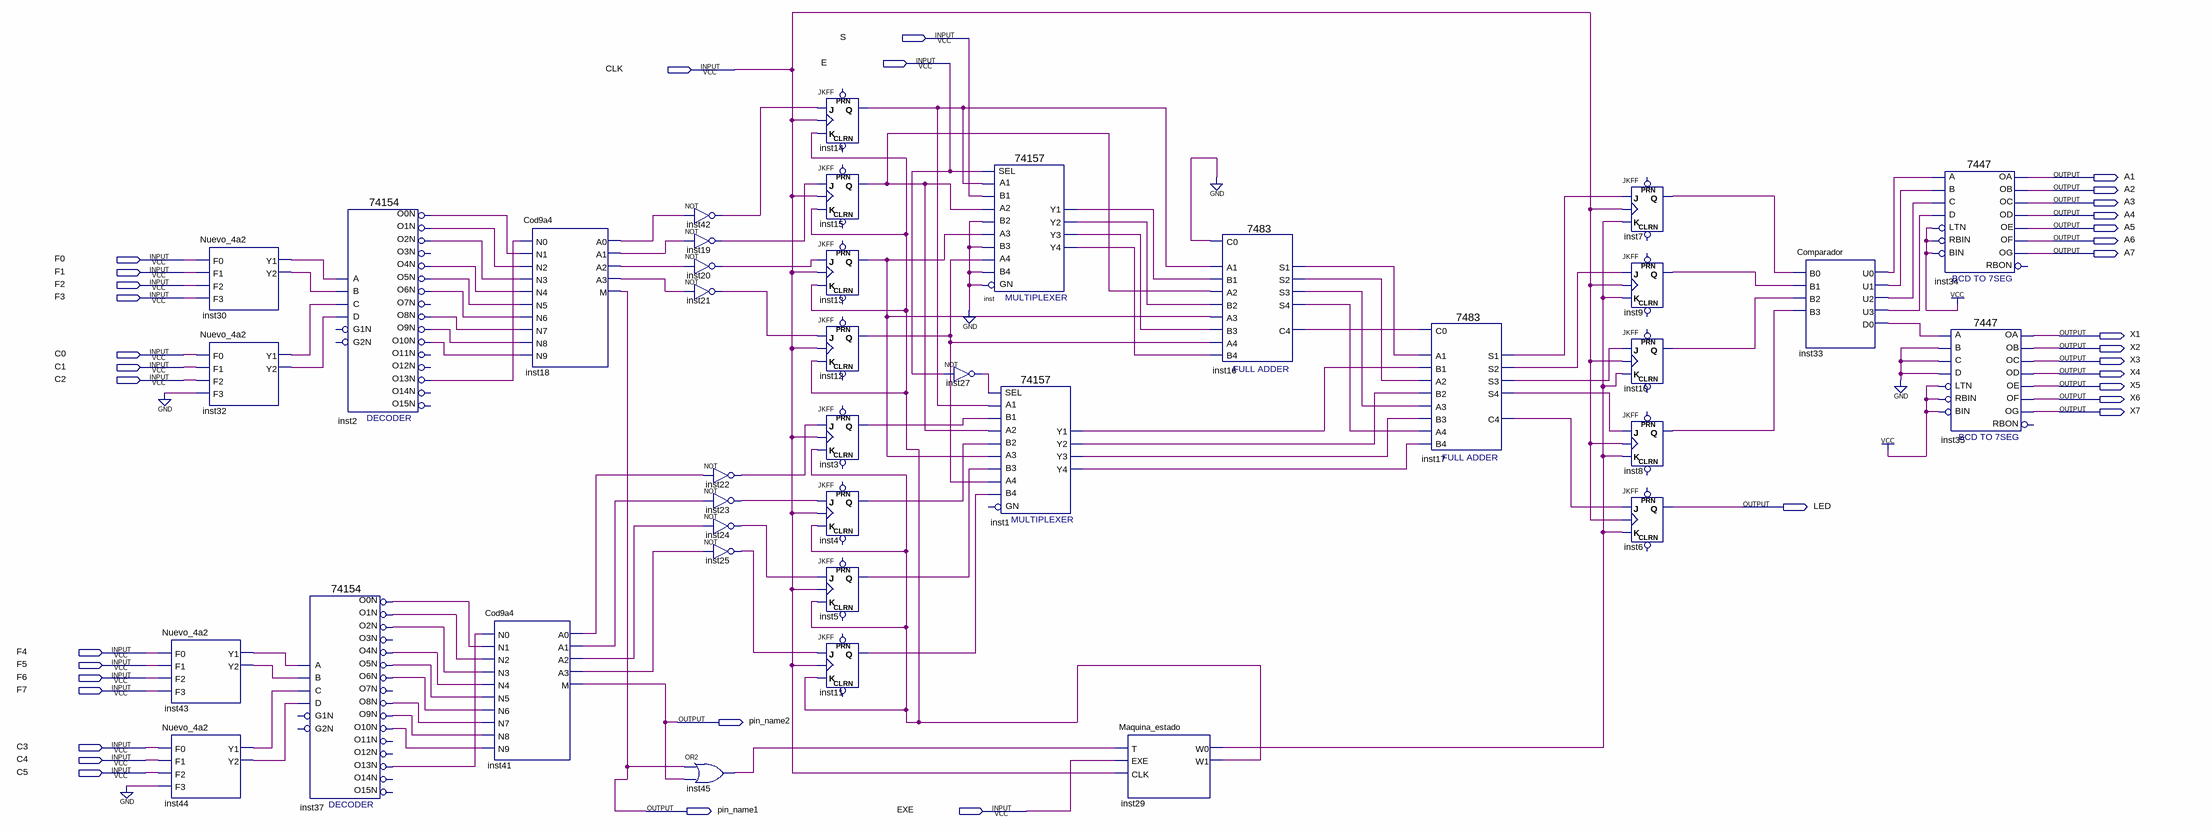
[diagram p0: schematic sheet]
// Quartus schematic Final_Digitales.bdf as structural Verilog: 39 symbols, 35 pins
module Final_Digitales (
  input  S,
  input  E,
  input  CLK,
  input  F0,
  input  F1,
  input  F2,
  input  F3,
  input  C0,
  input  C1,
  input  C2,
  input  F4,
  input  F5,
  input  F6,
  input  F7,
  input  C3,
  input  C4,
  input  C5,
  input  EXE,
  output A1,
  output A2,
  output A3,
  output A4,
  output A5,
  output A6,
  output A7,
  output X1,
  output X2,
  output X3,
  output X4,
  output X5,
  output X6,
  output X7,
  output LED,
  output pin_name2,
  output pin_name1
);

  wire inst1_y1, inst1_y2, inst1_y3, inst1_y4, inst2_o0n, inst2_o1n, inst2_o2n, inst2_o4n, inst2_o5n,
       inst2_o6n, inst2_o8n, inst2_o9n, inst2_o10n, inst2_o13n, inst3_q, inst4_q, inst5_q, inst7_q, inst8_q,
       inst9_q, inst10_q, inst11_q, inst12_q, inst13_q, inst14_q, inst15_q, inst16_c4, inst16_s1, inst16_s2,
       inst16_s3, inst16_s4, inst17_c4, inst17_s1, inst17_s2, inst17_s3, inst17_s4, inst18_a0, inst18_a1,
       inst18_a2, inst18_a3, inst19_out, inst20_out, inst21_out, inst22_out, inst23_out, inst24_out,
       inst25_out, inst27_out, inst29_w0, inst29_w1, inst30_y1, inst30_y2, inst32_y1, inst32_y2, inst33_d0,
       inst33_u0, inst33_u1, inst33_u2, inst33_u3, inst37_o0n, inst37_o1n, inst37_o2n, inst37_o4n,
       inst37_o5n, inst37_o6n, inst37_o8n, inst37_o9n, inst37_o10n, inst37_o13n, inst41_a0, inst41_a1,
       inst41_a2, inst41_a3, inst42_out, inst43_y1, inst43_y2, inst44_y1, inst44_y2, inst45_out, inst_y1,
       inst_y2, inst_y3, inst_y4;

  Nuevo_4a2 inst43 (.F0(F4), .F1(F5), .F2(F6), .F3(F7), .Y1(inst43_y1), .Y2(inst43_y2));
  Nuevo_4a2 inst44 (.F0(C3), .F1(C4), .F2(C5), .F3(1'b0), .Y1(inst44_y1), .Y2(inst44_y2));
  Nuevo_4a2 inst30 (.F0(F0), .F1(F1), .F2(F2), .F3(F3), .Y1(inst30_y1), .Y2(inst30_y2));
  Nuevo_4a2 inst32 (.F0(C0), .F1(C1), .F2(C2), .F3(1'b0), .Y1(inst32_y1), .Y2(inst32_y2));
  \74154  inst2 (
    .C(inst32_y1), .D(inst32_y2), .B(inst30_y2), .A(inst30_y1), .O0N(inst2_o0n), .O10N(inst2_o10n),
    .O1N(inst2_o1n), .O13N(inst2_o13n), .O4N(inst2_o4n), .O2N(inst2_o2n), .O6N(inst2_o6n), .O5N(inst2_o5n),
    .O9N(inst2_o9n), .O8N(inst2_o8n));  // open: G1N, G2N, O12N, O15N, O11N, O14N, O3N, O7N
  \74154  inst37 (
    .C(inst44_y1), .D(inst44_y2), .B(inst43_y2), .A(inst43_y1), .O0N(inst37_o0n), .O10N(inst37_o10n),
    .O1N(inst37_o1n), .O13N(inst37_o13n), .O4N(inst37_o4n), .O2N(inst37_o2n), .O6N(inst37_o6n),
    .O5N(inst37_o5n), .O9N(inst37_o9n), .O8N(inst37_o8n));  // open: G1N, G2N, O12N, O15N, O11N, O14N, O3N, O7N
  Cod9a4 inst41 (
    .N0(inst37_o13n), .N1(inst37_o0n), .N2(inst37_o1n), .N3(inst37_o2n), .N4(inst37_o4n), .N5(inst37_o5n),
    .N6(inst37_o6n), .N7(inst37_o8n), .N8(inst37_o9n), .N9(inst37_o10n), .A0(inst41_a0), .A1(inst41_a1),
    .A2(inst41_a2), .A3(inst41_a3), .M(pin_name2));
  Cod9a4 inst18 (
    .N0(inst2_o13n), .N1(inst2_o0n), .N2(inst2_o1n), .N3(inst2_o2n), .N4(inst2_o4n), .N5(inst2_o5n),
    .N6(inst2_o6n), .N7(inst2_o8n), .N8(inst2_o9n), .N9(inst2_o10n), .A0(inst18_a0), .A1(inst18_a1),
    .A2(inst18_a2), .A3(inst18_a3), .M(pin_name1));
  not inst42 (inst42_out, inst18_a0);
  not inst19 (inst19_out, inst18_a1);
  not inst20 (inst20_out, inst18_a2);
  not inst21 (inst21_out, inst18_a3);
  or inst45 (inst45_out, pin_name1, pin_name2);
  not inst22 (inst22_out, inst41_a0);
  not inst23 (inst23_out, inst41_a1);
  not inst24 (inst24_out, inst41_a2);
  not inst25 (inst25_out, inst41_a3);
  JKFF inst14 (.K(inst29_w1), .J(inst42_out), .CLK(CLK), .Q(inst14_q));  // open: PRN, CLRN
  JKFF inst15 (.K(inst29_w1), .J(inst19_out), .CLK(CLK), .Q(inst15_q));  // open: PRN, CLRN
  JKFF inst13 (.K(inst29_w1), .J(inst20_out), .CLK(CLK), .Q(inst13_q));  // open: PRN, CLRN
  JKFF inst12 (.K(inst29_w1), .J(inst21_out), .CLK(CLK), .Q(inst12_q));  // open: PRN, CLRN
  JKFF inst3 (.K(inst29_w1), .J(inst22_out), .CLK(CLK), .Q(inst3_q));  // open: PRN, CLRN
  JKFF inst4 (.K(inst29_w1), .J(inst23_out), .CLK(CLK), .Q(inst4_q));  // open: PRN, CLRN
  JKFF inst5 (.K(inst29_w1), .J(inst24_out), .CLK(CLK), .Q(inst5_q));  // open: PRN, CLRN
  JKFF inst11 (.K(inst29_w1), .J(inst25_out), .CLK(CLK), .Q(inst11_q));  // open: PRN, CLRN
  not inst27 (inst27_out, E);
  \74157  inst (
    .A1(inst14_q), .B1(S), .SEL(E), .B2(1'b0), .A3(inst13_q), .B3(1'b0), .A2(inst15_q), .B4(1'b0), .GN(1'b0),
    .A4(inst12_q), .Y2(inst_y2), .Y1(inst_y1), .Y4(inst_y4), .Y3(inst_y3));
  \74157  inst1 (
    .A1(inst14_q), .B1(inst3_q), .SEL(inst27_out), .B2(inst4_q), .A3(inst13_q), .B3(inst5_q), .A2(inst15_q),
    .B4(inst11_q), .A4(inst12_q), .Y2(inst1_y2), .Y1(inst1_y1), .Y4(inst1_y4), .Y3(inst1_y3));  // open: GN
  Maquina_estado inst29 (.T(inst45_out), .EXE(EXE), .CLK(CLK), .W0(inst29_w0), .W1(inst29_w1));
  \7483  inst16 (
    .B4(inst_y4), .C0(1'b0), .A1(inst14_q), .A2(inst15_q), .B1(inst_y1), .B2(inst_y2), .A3(inst13_q),
    .B3(inst_y3), .A4(inst12_q), .S3(inst16_s3), .S4(inst16_s4), .S2(inst16_s2), .C4(inst16_c4),
    .S1(inst16_s1));
  \7483  inst17 (
    .B4(inst1_y4), .C0(inst16_c4), .A1(inst16_s1), .A2(inst16_s2), .B1(inst1_y1), .B2(inst1_y2),
    .A3(inst16_s3), .B3(inst1_y3), .A4(inst16_s4), .S3(inst17_s3), .S4(inst17_s4), .S2(inst17_s2),
    .C4(inst17_c4), .S1(inst17_s1));
  JKFF inst7 (.K(inst29_w0), .J(inst17_s1), .CLK(CLK), .Q(inst7_q));  // open: PRN, CLRN
  JKFF inst9 (.K(inst29_w0), .J(inst17_s2), .CLK(CLK), .Q(inst9_q));  // open: PRN, CLRN
  JKFF inst10 (.K(inst29_w0), .J(inst17_s3), .CLK(CLK), .Q(inst10_q));  // open: PRN, CLRN
  JKFF inst8 (.K(inst29_w0), .J(inst17_s4), .CLK(CLK), .Q(inst8_q));  // open: PRN, CLRN
  JKFF inst6 (.K(inst29_w0), .J(inst17_c4), .CLK(CLK), .Q(LED));  // open: PRN, CLRN
  Comparador inst33 (
    .B0(inst7_q), .B1(inst9_q), .B2(inst10_q), .B3(inst8_q), .U0(inst33_u0), .U1(inst33_u1), .U2(inst33_u2),
    .U3(inst33_u3), .D0(inst33_d0));
  \7447  inst34 (
    .LTN(1'b1), .B(inst33_u1), .C(inst33_u2), .D(inst33_u3), .RBIN(1'b1), .BIN(1'b1), .A(inst33_u0), .OB(A2),
    .OC(A3), .OE(A5), .OD(A4), .OF(A6), .OG(A7), .OA(A1));  // open: RBON
  \7447  inst35 (
    .LTN(1'b1), .B(1'b0), .C(1'b0), .D(1'b0), .RBIN(1'b1), .BIN(1'b1), .A(inst33_d0), .OB(X2), .OC(X3),
    .OE(X5), .OD(X4), .OF(X6), .OG(X7), .OA(X1));  // open: RBON
endmodule
